# Altium schematic sheet PDM-S09-V00-HarnessConnector.SchDoc: Harness Connectors
size A3; DrawnBy: Zoe Goodward; Organization: QUT Motorsport; Address1: O-120, Gardens Point; Address2: 2 George Street; Address3: Brisbane, QLD 4000; Address4: Australia; DocumentNumber: 9; Revision: 01; SheetNumber: 9; SheetTotal: 9; Version: 01; Project: Power Distribution Module; PageSetup: Record=PageOptions|CenterHorizontal=True|CenterVertical=True|PrintScale=0.97|XCorrection=1.00|YCorrection=1.00|PrintKind=0|BorderSize=5000000|LeftOffset=0|BottomOffset=0|Orientation=2|PaperLength=1000|PaperWidth=1000|Scale=100|PaperSource=7|PrintQuality=-4|MediaType=1|DitherType=10|PaperKind=A4|PrintScaleMode=1
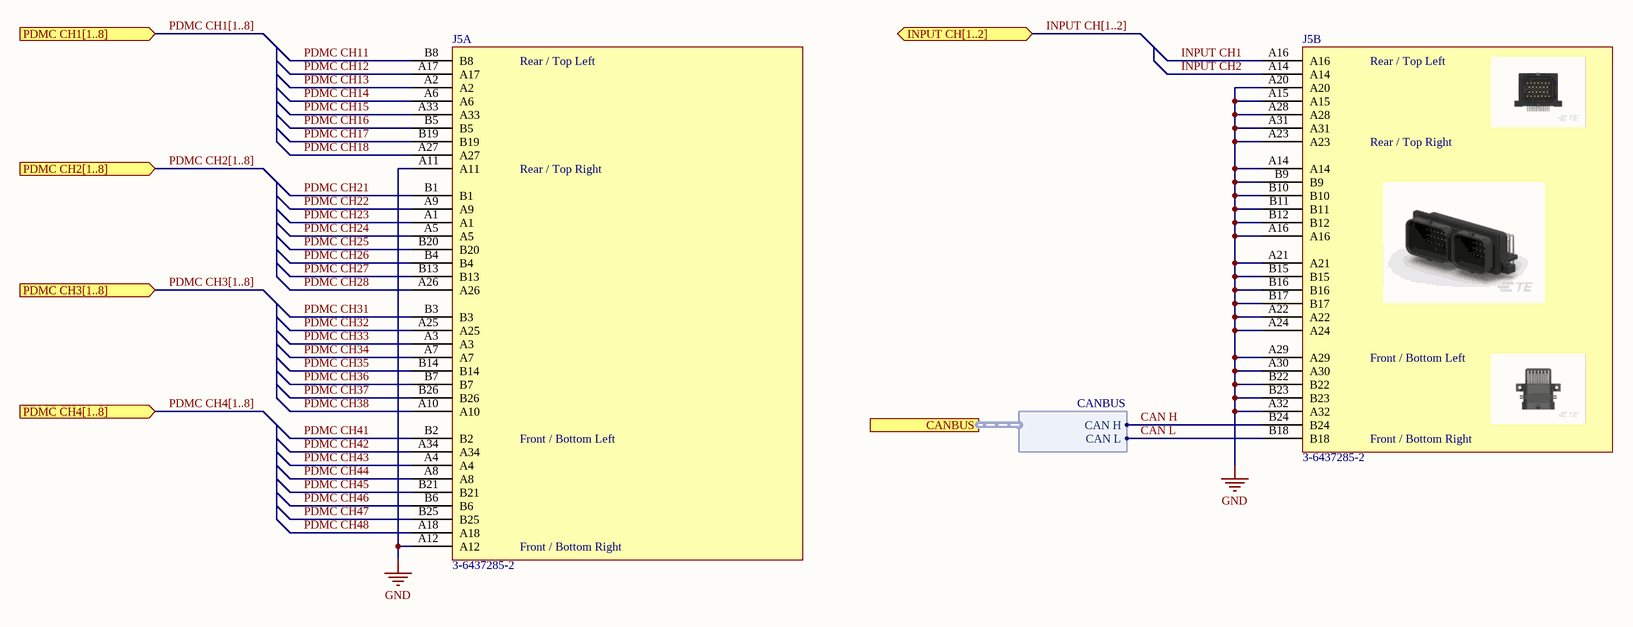
[diagram p0: PDM-S09-V00-HarnessConnector.SchDoc]

## Parts
J5  3-6437285-2  [SUPER SEAL RIGHT 60POS]  (parts A,B of 2)

## Ports
CANBUS (harness CANBUS), INPUT CH[1..2] (bidir), PDMC CH1[1..8] (in), PDMC CH2[1..8] (in), PDMC CH3[1..8] (in), PDMC CH4[1..8] (in)

## Harnesses
CANBUS: CAN H, CAN L

## Nets
GND: J5.A11 J5.A12 J5.A14 J5.A15 J5.A16 J5.A20 J5.A21 J5.A22 J5.A23 J5.A24 J5.A28 J5.A29 J5.A30 J5.A31 J5.A32 J5.B9 J5.B10 J5.B11 J5.B12 J5.B15 J5.B16 J5.B17 J5.B22 J5.B23
CAN H: J5.B24 ; port CANBUS.CAN H
CAN L: J5.B18 ; port CANBUS.CAN L
INPUT CH1: J5.A16
INPUT CH2: J5.A14
PDMC CH11: J5.B8
PDMC CH12: J5.A17
PDMC CH13: J5.A2
PDMC CH14: J5.A6
PDMC CH15: J5.A33
PDMC CH16: J5.B5
PDMC CH17: J5.B19
PDMC CH18: J5.A27
PDMC CH21: J5.B1
PDMC CH22: J5.A9
PDMC CH23: J5.A1
PDMC CH24: J5.A5
PDMC CH25: J5.B20
PDMC CH26: J5.B4
PDMC CH27: J5.B13
PDMC CH28: J5.A26
PDMC CH31: J5.B3
PDMC CH32: J5.A25
PDMC CH33: J5.A3
PDMC CH34: J5.A7
PDMC CH35: J5.B14
PDMC CH36: J5.B7
PDMC CH37: J5.B26
PDMC CH38: J5.A10
PDMC CH41: J5.B2
PDMC CH42: J5.A34
PDMC CH43: J5.A4
PDMC CH44: J5.A8
PDMC CH45: J5.B21
PDMC CH46: J5.B6
PDMC CH47: J5.B25
PDMC CH48: J5.A18

## Buses and harness runs
bus INPUT CH[1..2] = port INPUT CH[1..2]
bus PDMC CH1[1..8] = port PDMC CH1[1..8]
bus PDMC CH2[1..8] = port PDMC CH2[1..8]
bus PDMC CH3[1..8] = port PDMC CH3[1..8]
bus PDMC CH4[1..8] = port PDMC CH4[1..8]

## Notes on the sheet
- Revision History:
- Sheet Title:
- Rev
- Date
- Description
- Project:
- Size:
- Drawn By:
- A3
- Number:
- Revision:
- Sheet
- Version:
- of
- QUT Motorsport
- O-120, Gardens Point
- 2 George Street
- Brisbane, QLD 4000
- Australia
- Print Date:
- Print Time:
- File Name:
- (in symbol 3-6437285-2, part A) Rear / Top Left; Rear / Top Right; Front / Bottom Left; Front / Bottom Right
- (in symbol 3-6437285-2, part B) Rear / Top Left; Rear / Top Right; Front / Bottom Left; Front / Bottom Right

## Library data of the parts
J5 = 3-6437285-2: Connector Header Through Hole, Right Angle 60 position 0.118" (3.00mm), 1.00mm contacts; ComponentLink1Description: Manufacturer; ComponentLink1URL: https://www.te.com/global-en/product-3-6437285-2.html